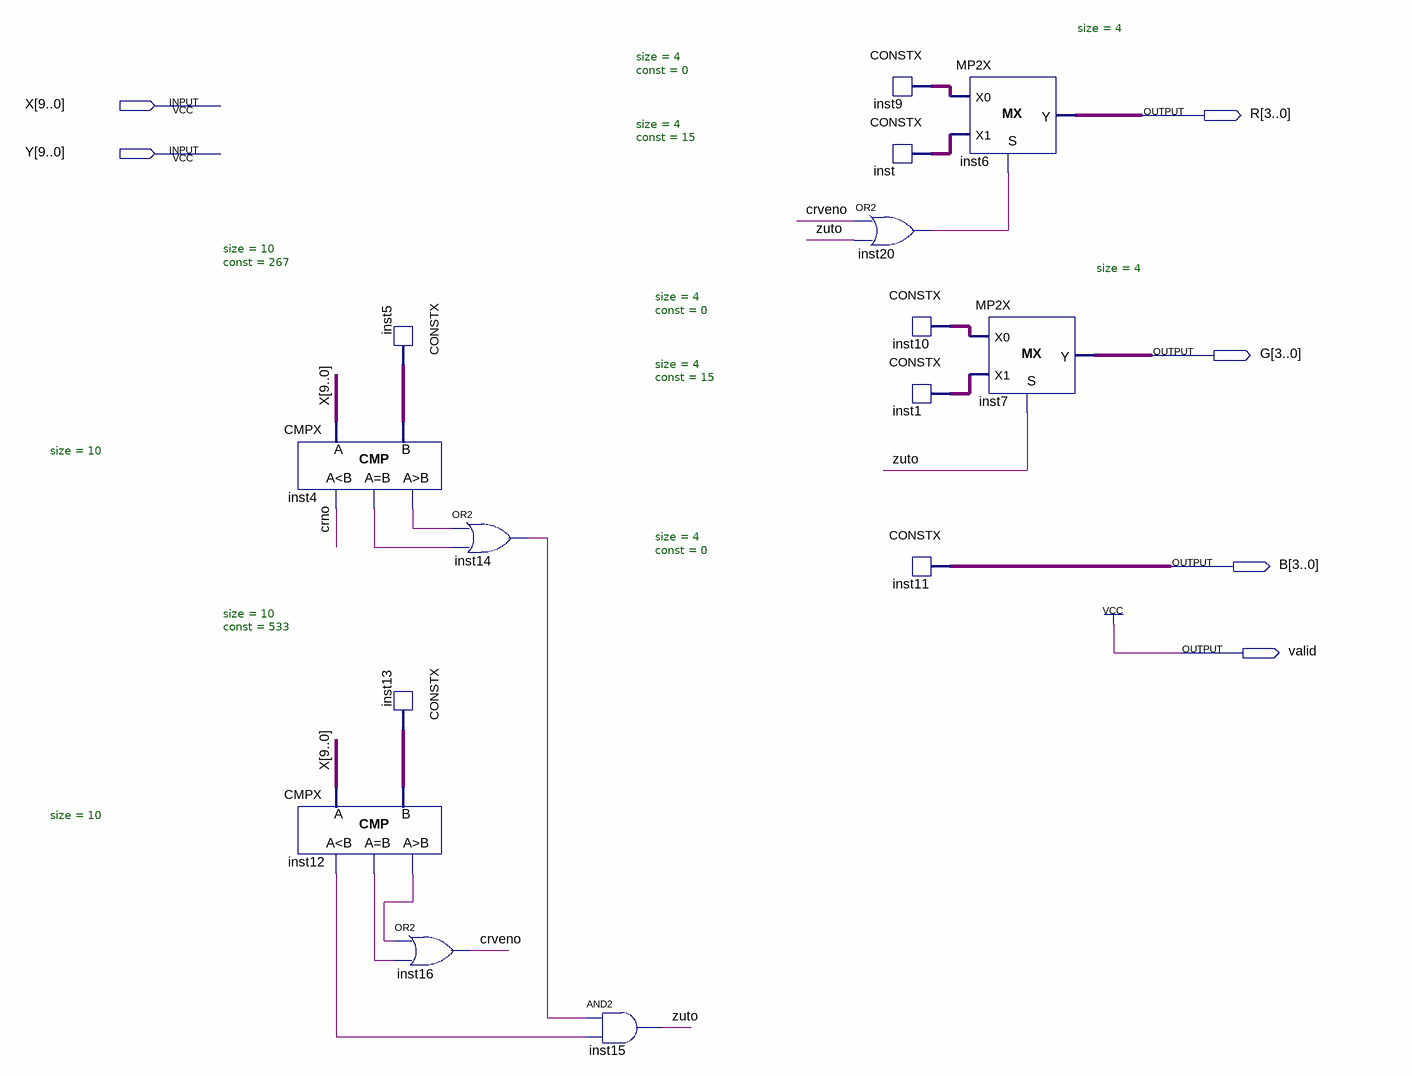
[diagram p0: schematic sheet]
// Quartus schematic Belgija.bdf as structural Verilog: 15 symbols, 6 pins
module Belgija (
  input  [9:0] X,
  input  [9:0] Y,
  output [3:0] R,
  output [3:0] G,
  output [3:0] B,
  output valid
);

  wire crno, crveno, inst4_eq, inst4_gr, inst12_eq, inst12_gr, inst12_ls, inst14_out, inst20_out, zuto;
  wire [3:0] inst1_data, inst9_data, inst10_data, inst_data;
  wire [9:0] inst5_data, inst13_data;

  CMPX #(.size(10)) inst4 (.A(X), .B(inst5_data), .ls(crno), .eq(inst4_eq), .gr(inst4_gr));
  CMPX #(.size(10)) inst12 (.A(X), .B(inst13_data), .ls(inst12_ls), .eq(inst12_eq), .gr(inst12_gr));
  CONSTX #(.size(10), .\const (267)) inst5 (.data(inst5_data));
  CONSTX #(.size(10), .\const (533)) inst13 (.data(inst13_data));
  or inst14 (inst14_out, inst4_gr, inst4_eq);
  or inst16 (crveno, inst12_gr, inst12_eq);
  and inst15 (zuto, inst14_out, inst12_ls);
  CONSTX #(.size(4), .\const (0)) inst9 (.data(inst9_data));
  CONSTX #(.size(4), .\const (15)) inst (.data(inst_data));
  or inst20 (inst20_out, crveno, zuto);
  CONSTX #(.size(4), .\const (0)) inst10 (.data(inst10_data));
  CONSTX #(.size(4), .\const (15)) inst1 (.data(inst1_data));
  CONSTX #(.size(4), .\const (0)) inst11 (.data(B));
  MP2X #(.size(4)) inst6 (.S(inst20_out), .X0(inst9_data), .X1(inst_data), .Y(R));
  MP2X #(.size(4)) inst7 (.S(zuto), .X0(inst10_data), .X1(inst1_data), .Y(G));

  assign valid = 1'b1;
endmodule
